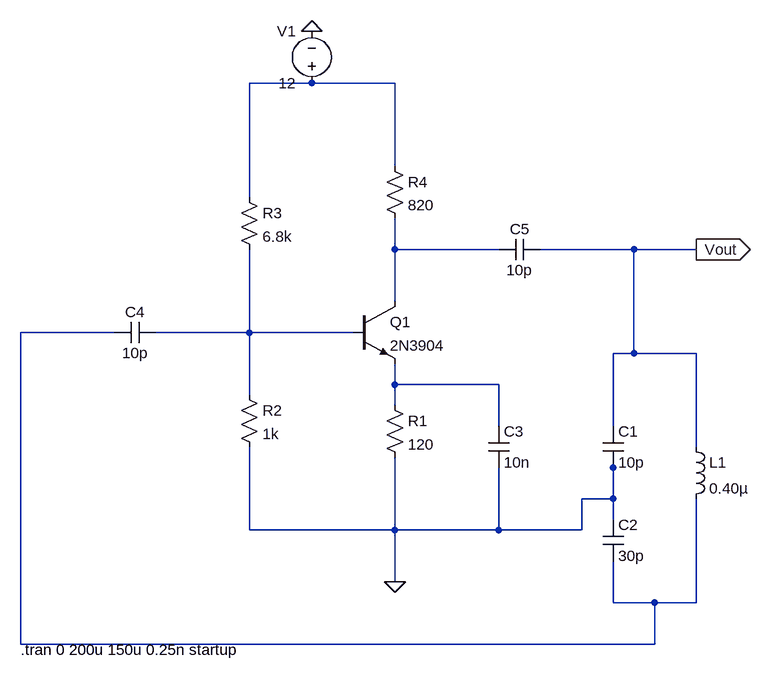
[diagram p0: schematic Hartley_Oscillator.asc]
Hartley_Oscillator.asc, the LTspice schematic file:
Version 4.1
SHEET 1 1460 680
WIRE -16 -272 -112 -272
WIRE 112 -272 -16 -272
WIRE 112 -144 112 -272
WIRE -112 -96 -112 -272
WIRE 112 -16 112 -64
WIRE 272 -16 112 -16
WIRE 480 -16 336 -16
WIRE 576 -16 480 -16
WIRE 112 64 112 -16
WIRE -320 112 -464 112
WIRE -112 112 -112 -16
WIRE -112 112 -256 112
WIRE 48 112 -112 112
WIRE 480 144 480 -16
WIRE 480 144 448 144
WIRE 576 144 480 144
WIRE 112 192 112 160
WIRE 272 192 112 192
WIRE -112 208 -112 112
WIRE 112 224 112 192
WIRE 272 256 272 192
WIRE 448 256 448 144
WIRE 576 288 576 144
WIRE 448 320 448 304
WIRE 448 368 448 320
WIRE 448 368 400 368
WIRE 448 400 448 368
WIRE -112 416 -112 288
WIRE 112 416 112 304
WIRE 112 416 -112 416
WIRE 272 416 272 320
WIRE 272 416 112 416
WIRE 400 416 400 368
WIRE 400 416 272 416
WIRE 112 496 112 416
WIRE 448 528 448 464
WIRE 512 528 448 528
WIRE 576 528 576 368
WIRE 576 528 512 528
WIRE -464 592 -464 112
WIRE 512 592 512 528
WIRE 512 592 -464 592
FLAG -16 -352 0
FLAG 112 496 0
FLAG 576 -16 Vout
IOPIN 576 -16 Out
SYMBOL npn 48 64 R0
SYMATTR InstName Q1
SYMATTR Value 2N3904
SYMBOL res 96 208 R0
SYMATTR InstName R1
SYMATTR Value 120
SYMBOL res -128 192 R0
SYMATTR InstName R2
SYMATTR Value 1k
SYMBOL res -128 -112 R0
SYMATTR InstName R3
SYMATTR Value 6.8k
SYMBOL ind 560 272 R0
SYMATTR InstName L1
SYMATTR Value 0.40µ
SYMBOL cap 432 256 R0
SYMATTR InstName C1
SYMATTR Value 10p
SYMBOL cap 432 400 R0
SYMATTR InstName C2
SYMATTR Value 30p
SYMBOL voltage -16 -256 R180
WINDOW 0 24 96 Left 2
WINDOW 3 24 16 Left 2
WINDOW 123 0 0 Left 0
WINDOW 39 0 0 Left 0
SYMATTR InstName V1
SYMATTR Value 12
SYMBOL cap 256 256 R0
SYMATTR InstName C3
SYMATTR Value 10n
SYMBOL cap -256 96 R90
WINDOW 0 0 32 VBottom 2
WINDOW 3 32 32 VTop 2
SYMATTR InstName C4
SYMATTR Value 10p
SYMBOL cap 336 -32 R90
WINDOW 0 0 32 VBottom 2
WINDOW 3 32 32 VTop 2
SYMATTR InstName C5
SYMATTR Value 10p
SYMBOL res 96 -160 R0
SYMATTR InstName R4
SYMATTR Value 820
TEXT -464 600 Left 2 !.tran 0 200u 150u 0.25n startup

The netlist it stands for:
* Hartley_Oscillator.asc
Q1 N002 N004 N005 0 2N3904
R1 N005 0 120
R2 N004 0 1k
R3 N001 N004 6.8k
L1 Vout N003 0.40µ
C1 Vout 0 10p
C2 0 N003 30p
V1 N001 0 12
C3 N005 0 10n
C4 N004 N003 10p
C5 Vout N002 10p
R4 N001 N002 820
.model NPN NPN
.model PNP PNP
.lib standard.bjt
.tran 0 200u 150u 0.25n startup
.backanno
.end